# Altium schematic sheet Power Supply.SchDoc: Power Supply
size A4; Author: EH; DrawnBy: Tyler Steane; Organization: Oar Inspired Pty Ltd; DocumentNumber: 2; Revision: 1.3; SheetNumber: 2; SheetTotal: 5; Website: www.oarinspired.com.au
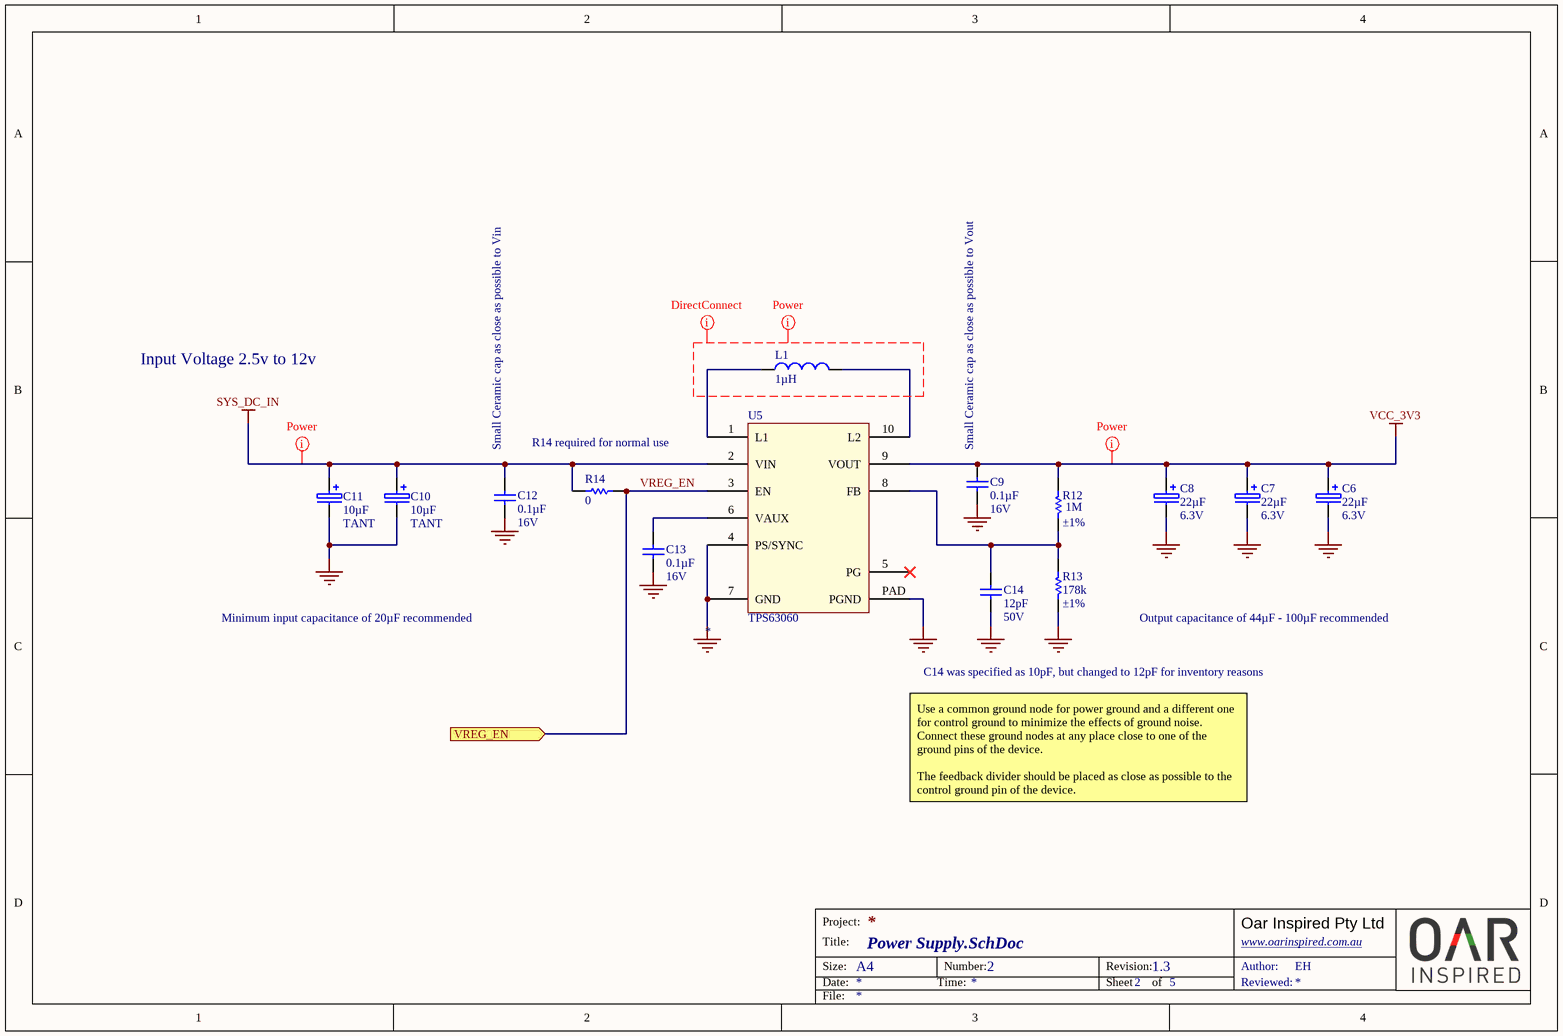
[diagram p0: Power Supply.SchDoc]

## Parts
C6  value 22µF  Voltage: 6.3V  [CASE-A]  (hidden comment: TANTALUM)
C7  value 22µF  Voltage: 6.3V  [CASE-A]  (hidden comment: TANTALUM)
C8  value 22µF  Voltage: 6.3V  [CASE-A]  (hidden comment: TANTALUM)
C9  value 0.1µF  Voltage: 16V  [C0402]  (hidden comment: Cap Ceramic)
C10  value 10µF  Type: TANT  [CASE-A]  (hidden comment: TANTALUM)
C11  value 10µF  Type: TANT  [CASE-A]  (hidden comment: TANTALUM)
C12  value 0.1µF  Voltage: 16V  [C0402]  (hidden comment: Cap Ceramic)
C13  value 0.1µF  Voltage: 16V  [C0402]  (hidden comment: Cap Ceramic)
C14  value 12pF  Voltage: 50V  [C0402]  (hidden comment: Cap Ceramic)
L1  value 1µH  [ASPI-4020S]  (hidden comment: Inductor)
R12  value 1M  Tolerance: ±1%  [R0603]  (hidden comment: Resistor)
R13  value 178k  Tolerance: ±1%  [R0603]  (hidden comment: Resistor)
R14  value 0  [R0402]  (hidden comment: Jumper)
U5  TPS63060  [PWSON-N10]

## Ports
VREG_EN (in)

## Nets
GND: C6.2 C7.2 C8.2 C9.2 C10.2 C11.2 C12.2 C13.2 C14.2 R13.2 U5.4(PS/SYNC) U5.7(GND) U5.PAD(PGND)
SYS_DC_IN: C10.1 C11.1 C12.1 R14.1 U5.2(VIN)
VCC_3V3: C6.1 C7.1 C8.1 C9.1 R12.1 U5.9(VOUT)
VREG_EN: R14.2 U5.3(EN) ; port VREG_EN
NetC13_1: C13.1 U5.6(VAUX)
NetC14_1: C14.1 R12.2 R13.1 U5.8(FB)
NetL1_1: L1.1 U5.1(L1)
NetL1_2: L1.2 U5.10(L2)

Not connected (* = marked no-connect by the designer): U5 5(PG)*

## Layout directives
net class Power: (no net found under the mark), SYS_DC_IN, VCC_3V3
net class DirectConnect: (no net found under the mark)

## Notes on the sheet
- Input Voltage 2.5v to 12v
- (near C12) Small Ceramic cap as close as possible to Vin
- R14 required for normal use
- (near C9) Small Ceramic cap as close as possible to Vout
- Minimum input capacitance of 20µF recommended
- Output capacitance of 44µF - 100µF recommended
- C14 was specified as 10pF, but changed to 12pF for inventory reasons
- Use a common ground node for power ground and a different one for control ground to minimize the effects of ground noise. Connect these ground nodes at any place close to one of the ground pins of the device.
  The feedback divider should be placed as close as possible to the control ground pin of the device.
- Project:
- Size:
- Date:
- Title:
- A4
- Time:
- Number:
- Revision:
- Sheet
- of
- Oar Inspired Pty Ltd
- Author:
- Reviewed:
- www.oarinspired.com.au <http://www.oarinspired.com.au>
- File:

## Library data of the parts
C6-C8 = C01754: CAP TANT 22UF 6.3V 10% 1206; Part Number: C01754; Manufacturer: AVX Corporation; Manufacturer Part No: TAJA226K006RNJ; Temperature Coefficient: X5R; Supplier 1: Digi-Key; HelpURL: http://datasheets.avx.com/TAJ.pdf; Type: TANT; Case: CASE-A; Supplier Part Number 1: 478-3865-6-ND; Tolerance: ±10%; Operating Temperature: -55°C ~ 125°C
C9 C12 C13 = C01054: CAP CER 0.1UF 16V X7R 0402; Part Number: C01054; Manufacturer: MuRata; Manufacturer Part No: GRM155R71C104JA88D; Tolerance: ±5%; Supplier 1: Digi-Key; Supplier Part Number 1: 490-6327-1-ND; HelpURL: http://www.murata.com/~/media/webrenewal/support/library/catalog/products/capacitor/mlcc/c02e.ashx; Operating Temperature: -55°C ~ 125°C; Type: CER; Temperature Coefficient: X7R
C10 C11 = C01756: CAP TANT 10UF 16V 20% 1206; Part Number: C01756; Manufacturer: Rohm Semiconductor; Manufacturer Part No: TCA1C106M8R; Voltage: 16V; Supplier 1: Digi-Key; HelpURL: http://rohmfs.rohm.com/en/products/databook/datasheet/passive/tantalum_capacitor/tantalum_chip_capacitor/tc_a.pdf; Case: CASE-A; Supplier Part Number 1: 511-1473-1-ND; Tolerance: ±20%; Operating Temperature: -55°C ~ 125°C
C14 = C00087: CAP CER 12PF 50V NP0 0402; Part Number: C00087; Manufacturer: MuRata; Manufacturer Part No: GRM1555C1H120JA01D; Tolerance: ±5%; Temperature Coefficient: C0G, NP0; Supplier 1: Digi-Key; Supplier Part Number 1: 490-5924-1-ND; HelpURL: http://www.murata.com/~/media/webrenewal/support/library/catalog/products/capacitor/mlcc/c02e.ashx; Operating Temperature: -55°C ~ 125°C; Type: CER
L1 = IND0044: FIXED IND 1UH 2.15A 29 MOHM SMD; Manufacturer: Abracon LLC; Manufacturer Part No: ASPI-4020S-1R0N-T; Shielding: Shielded; Type: Wirewound; Current - Saturation: 4.78A; Part Number: IND0044; Current Rating: 2.15A; HelpURL: http://www.abracon.com/Magnetics/power/ASPI-4020S.pdf; Operating Temperature: -40°C ~ 125°C; Supplier 1: Digi-Key; Supplier Part Number 1: 535-12306-1-ND
R12 = RES_YAG_RC0603FR-071ML: RES SMD 1M OHM 1% 1/10W 0603; Manufacturer: Yageo; Power: 0.1W, 1/10W; Temperature Coefficient: ±100ppm/°C; Part Number: RES_YAG_RC0603FR-071ML; Supplier 1: Digi-Key; Supplier Part Number 1: 311-1.00MHRCT-ND; HelpURL: http://www.yageo.com/documents/recent/PYu-RC_Group_51_RoHS_L_04.pdf; Operating Temperature: -55°C ~ 155°C; Manufacturer Part No: RC0603FR-071ML
R13 = RES_YAG_RC0603FR-07178KL: RES SMD 178K OHM 1% 1/10W 0603; Manufacturer: Yageo; Power: 0.1W, 1/10W; Temperature Coefficient: ±100ppm/°C; Part Number: RES_YAG_RC0603FR-07178KL; Supplier 1: Digi-Key; Supplier Part Number 1: 311-178KHRCT-ND; HelpURL: http://www.yageo.com/documents/recent/PYu-RC_Group_51_RoHS_L_04.pdf; Operating Temperature: -55°C ~ 155°C; Manufacturer Part No: RC0603FR-07178KL
R14 = RES_YAG_RC0402JR-070RL: RES SMD 0.0OHM JUMPER 1/16W 0402; Manufacturer: Yageo; Power: 0.063W, 1/16W; Part Number: RES_YAG_RC0402JR-070RL; Manufacturer Part No: RC0402JR-070RL; Supplier 1: Digi-Key; Supplier Part Number 1: 311-0.0JRCT-ND; HelpURL: http://www.yageo.com/documents/recent/PYu-RC_Group_51_RoHS_L_04.pdf; Tolerance: Jumper; Temperature Coefficient: -; Operating Temperature: -55°C ~ 155°C
U5 = 5030: IC REG BUCK BOOST ADJ 2A 10WSON; Manufacturer: Texas Instruments; Part Number: 5030; Manufacturer Part No: TPS63060DSCR; Budget Cost: 100; Manufacture Part No: TPS63060; Supplier 1: Digi-Key; Supplier Part Number 1: 296-30204-1-ND; SmallFootprint: *